# EAGLE design stm_teensy (EAGLE 9.5.2)
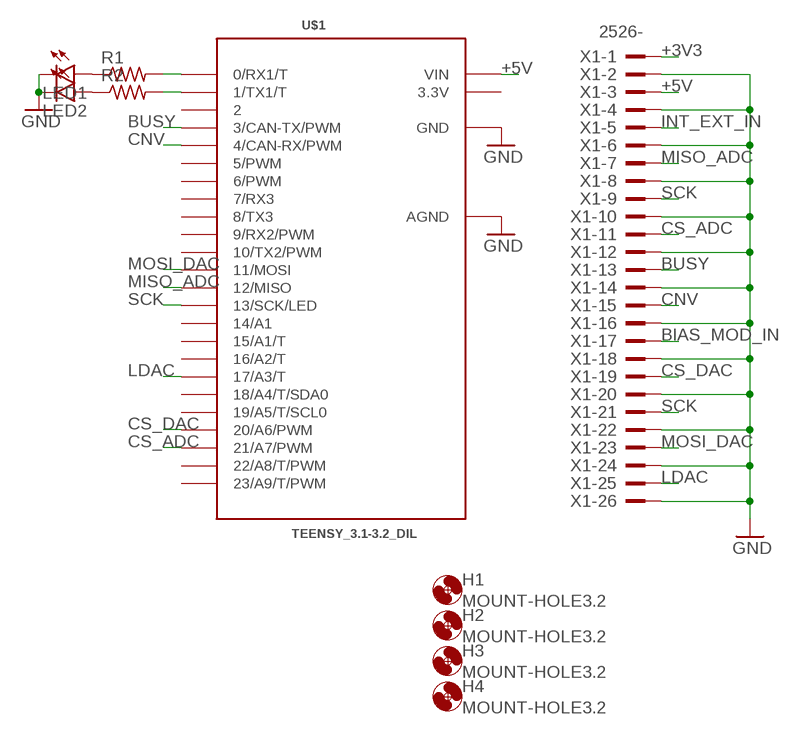
[diagram p0: schematic, sheet 1]

## Parts
H1  MOUNT-HOLE3.2  [3,2]
H2  MOUNT-HOLE3.2  [3,2]
H3  MOUNT-HOLE3.2  [3,2]
H4  MOUNT-HOLE3.2  [3,2]
LED1  LED5MM  [LED5MM]
LED2  LED5MM  [LED5MM]
R1  R-US_0204/7  [0204/7]
R2  R-US_0204/7  [0204/7]
U$1  TEENSY_3.1-3.2_DIL  [TEENSY_3.0-3.2&LC_DIL]
X1  2526-  [PAK100/2500-26]

## Nets
+3V3: X1.1
+5V: U$1.VIN X1.3
BIAS_MOD_IN: X1.17
BUSY: U$1.3(3/CAN-TX/PWM) X1.13
CNV: U$1.4(4/CAN-RX/PWM) X1.15
CS_ADC: U$1.21/A7(21/A7/PWM) X1.11
CS_DAC: U$1.20/A6(20/A6/PWM) X1.19
GND: LED1.K(C) LED2.K(C) U$1.AGND U$1.GND X1.2 X1.4 X1.6 X1.8 X1.10 X1.12 X1.14 X1.16 X1.18 X1.20 X1.22 X1.24 X1.26
INT_EXT_IN: X1.5
LDAC: U$1.17/A3(17/A3/T) X1.25
MISO_ADC: U$1.12(12/MISO) X1.7
MOSI_DAC: U$1.11(11/MOSI) X1.23
N$1: LED1.A R1.1
N$2: LED2.A R2.1
N$10: R1.2 U$1.0(0/RX1/T)
N$11: R2.2 U$1.1(1/TX1/T)
SCK: U$1.13(13/SCK/LED) X1.9 X1.21
Unconnected: U$1.2 U$1.5(5/PWM) U$1.6(6/PWM) U$1.7(7/RX3) U$1.8(8/TX3) U$1.9(9/RX2/PWM) U$1.10(10/TX2/PWM) U$1.14/A0(14/A1) U$1.15/A1(15/A1/T) U$1.16/A2(16/A2/T) U$1.18/A4(18/A4/T/SDA0) U$1.19/A5(19/A5/T/SCL0) U$1.22/A8(22/A8/T/PWM) U$1.23/A9(23/A9/T/PWM)

## Power pins joined to a net without a drawn wire
3.3V: U$1.3.3V

## Library data of the parts
H1-H4 = holes:MOUNT-HOLE: MOUNTING HOLE with drill center marker
LED1 LED2 = led:LED: LED OSRAM: - CHIPLED LG R971, LG N971, LY N971, LG Q971, LY Q971, LO R971, LY R971 LH N974, LH R974 LS Q976, LO Q976, LY Q976 LO Q996 - Hyper CHIPLED LW Q18S LB Q993, LB Q99A, LB R99A - SideLED LS A670, LO A670, LY A670, LG A670, LP A670 LB A673, LV A673, LT A673, LW A673 LH A674 LY A675 LS A676, LA A676, LO A676, LY A676, LW A676 LS A679, LY A679, LG A679 - Hyper Micro SIDELED® LS Y876, LA Y876, LO Y876, LY Y876 LT Y87S - SmartLED LW L88C, LW L88S LB L89C, LB L89S, LG L890 LS L89K, LO L89K, LY L89K LS L896, LA L896, LO L896, LY L896 - TOPLED LS T670, LO T670, LY T670, LG T670, LP T670 LSG T670, LSP T670, LSY T670, LOP T670, LYG T670 LG T671, LOG T671, LSG T671 LB T673, LV T673, LT T673, LW T673 LH T674 LS T676, LA T676, LO T676, LY T676, LB T676, LH T676, LSB T676, LW T676 LB T67C, LV T67C, LT T67C, LS T67K, LO T67K, LY T67K, LW E67C LS E67B, LA E67B, LO E67B, LY E67B, LB E67C, LV E67C, LT E67C LW T67C LS T679, LY T679, LG T679 LS T770, LO T770, LY T770, LG T770, LP T770 LB T773, LV T773, LT T773, LW T773 LH T774 LS E675, LA E675, LY E675, LS T675 LS T776, LA T776, LO T776, LY T776, LB T776 LHGB T686 LT T68C, LB T68C - Hyper Mini TOPLED® LB M676 - Mini TOPLED Santana® LG M470 LS M47K, LO M47K, LY M47K Source: http://www.osram.convergy.de LUXEON: - LUMILED® LXK2-PW12-R00, LXK2-PW12-S00, LXK2-PW14-U00, LXK2-PW14-V00 LXK2-PM12-R00, LXK2-PM12-S00, LXK2-PM14-U00 LXK2-PE12-Q00, LXK2-PE12-R00, LXK2-PE12-S00, LXK2-PE14-T00, LXK2-PE14-U00 LXK2-PB12-K00, LXK2-PB12-L00, LXK2-PB12-M00, LXK2-PB14-N00, LXK2-PB14-P00, LXK2-PB14-Q00 LXK2-PR12-L00, LXK2-PR12-M00, LXK2-PR14-Q00, LXK2-PR14-R00 LXK2-PD12-Q00, LXK2-PD12-R00, LXK2-PD12-S00 LXK2-PH12-R00, LXK2-PH12-S00 LXK2-PL12-P00, LXK2-PL12-Q00, LXK2-PL12-R00 Source: www.luxeon.com KINGBRIGHT: KA-3528ASYC Source: www.kingbright.com
R1 R2 = rcl:R-US_: RESISTOR, American symbol; SPICEPREFIX: R
U$1 = Teensy_3_and_LC_Series_Boards_v1.4:TEENSY_3.1-3.2_DIL: Teensy 3.1 or 3.2 in a DIL Layout.
X1 = con-3m:2526-: 3M (TM) Pak 100 4-Wall Header Source: 3M; OC_FARNELL: unknown; OC_NEWARK: unknown

## Board
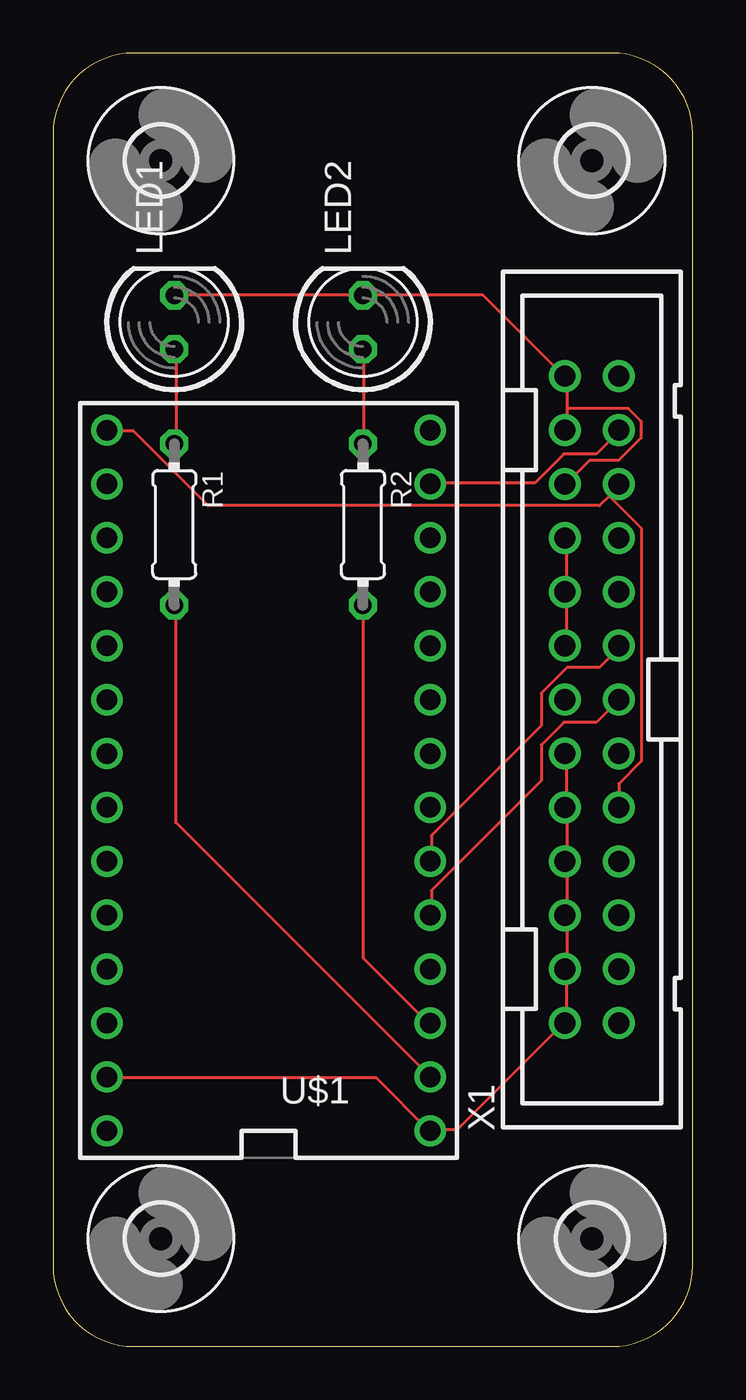
[diagram p1: board, top side]
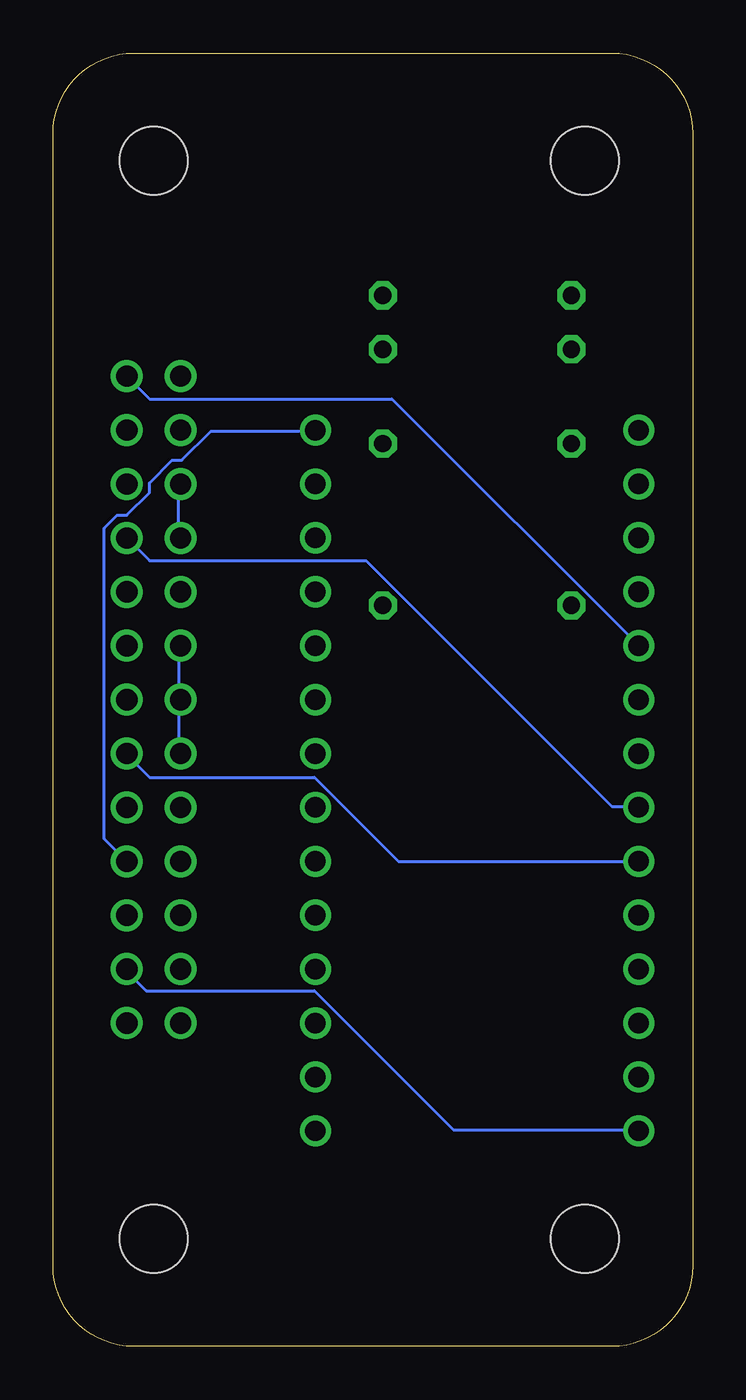
[diagram p2: board, bottom side, seen from below]

Size 30.15 x 60.95 mm. Coordinates in mm from the lower left corner, seen from the top.
Outline: 0,57.14 0,3.81 arc90 3.81,0 26.34,0 arc90 30.15,3.81 30.15,57.14 arc90 26.34,60.95 3.81,60.95 arc90 0,57.14
Copper layers (1*16): Top 0.035mm / dielectric 1.5mm / Bottom 0.035mm
Design rules "default": minimum track width 6mil, minimum drill 0.35mm, track to track 6mil, track to pad 6mil, pad to pad 6mil, via to via 6mil, smd to smd 6mil, copper to edge 40mil, drill to drill 6mil, minimum pad ring 10mil, minimum via ring 8mil, stop-mask expansion 4mil, vias tented up to drill 0mil, thermal gap 10mil

### Footprints (pad centres in the part's own frame; a part is rotated, then mirrored left to right if it is on the bottom)
3,2 = hole 3.2: 0,0
LED5MM = drill 0.813 octagon: A -1.27,0; K 1.27,0
0204/7 = drill 0.813 octagon: 1 -3.81,0; 2 3.81,0
TEENSY_3.0-3.2&LC_DIL = drill 0.965: 0 -7.62,13.97; 1 -7.62,11.43; 2 -7.62,8.89; 3 -7.62,6.35; 3.3V 7.62,11.43; 4 -7.62,3.81; 5 -7.62,1.27; 6 -7.62,-1.27; 7 -7.62,-3.81; 8 -7.62,-6.35; 9 -7.62,-8.89; 10 -7.62,-11.43; 11 -7.62,-13.97; 12 -7.62,-16.51; 13 7.62,-16.51; 14/A0 7.62,-13.97; 15/A1 7.62,-11.43; 16/A2 7.62,-8.89; 17/A3 7.62,-6.35; 18/A4 7.62,-3.81; 19/A5 7.62,-1.27; 20/A6 7.62,1.27; 21/A7 7.62,3.81; 22/A8 7.62,6.35; 23/A9 7.62,8.89; AGND 7.62,13.97; GND -7.62,16.51; VIN 7.62,16.51
PAK100/2500-26 = drill 1 pad 1.422: 1 -15.24,-1.27; 2 -15.24,1.27; 3 -12.7,-1.27; 4 -12.7,1.27; 5 -10.16,-1.27; 6 -10.16,1.27; 7 -7.62,-1.27; 8 -7.62,1.27; 9 -5.08,-1.27; 10 -5.08,1.27; 11 -2.54,-1.27; 12 -2.54,1.27; 13 0,-1.27; 14 0,1.27; 15 2.54,-1.27; 16 2.54,1.27; 17 5.08,-1.27; 18 5.08,1.27; 19 7.62,-1.27; 20 7.62,1.27; 21 10.16,-1.27; 22 10.16,1.27; 23 12.7,-1.27; 24 12.7,1.27; 25 15.24,-1.27; 26 15.24,1.27

### Placement (x,y rotation side)
H1  25.4,5.08 0 top
H2  25.4,55.88 0 top
H3  5.08,55.88 0 top
H4  5.08,5.08 0 top
LED1  5.71,48.26 90 top
LED2  14.61,48.26 90 top
R1  5.71,38.73 270 top
R2  14.61,38.73 270 top
U$1  10.16,26.67 180 top
X1  25.4,30.48 90 top

### Tracks (layer width: path | path; a pad name or v marks a point on that pad's centre or on a via)
+5V
  Bottom 0.152: U$1.VIN 2.59,10.21 11.28,10.21 17.83,16.76 25.76,16.76 26.67,17.68 X1.3
BUSY
  Top 0.152: X1.13 25.6,29.41 24.08,29.41 23.01,28.35 23.01,26.67 17.83,21.49 17.83,20.42 U$1.3
CNV
  Top 0.152: U$1.4 17.83,22.86 17.83,24.08 23.01,29.26 23.01,30.79 24.23,32 25.76,32 26.67,32.92 X1.15
CS_ADC
  Bottom 0.152: U$1.21/A7 13.87,22.86 17.83,26.82 25.6,26.82 26.67,27.89 X1.11
CS_DAC
  Bottom 0.152: X1.19 25.6,37.03 15.39,37.03 3.81,25.45 2.59,25.45 U$1.20/A6
GND
  Top 0.152: U$1.AGND 2.59,12.65 15.24,12.65 17.68,10.21 U$1.GND 17.83,10.21 19.05,10.21 24.08,15.24 X1.2 24.23,15.24 24.23,17.68 X1.4 24.23,17.83 24.23,20.27 X1.6 24.23,20.42 24.23,22.86 | LED1.K LED2.K 20.27,49.53 24.08,45.72 X1.26 24.23,45.72 24.23,44.2 | 24.23,22.86 24.23,25.3 X1.10 24.23,25.45 24.23,27.89 X1.12 | 24.23,44.2 24.23,43.28 X1.24 | X1.16 24.23,33.07 24.23,35.51 X1.18 24.23,35.66 24.23,38.1 X1.20 | 24.23,44.2 27.13,44.2 27.74,43.59 27.74,42.82 26.67,41.76 25.3,41.76 24.23,40.69 X1.22 | 24.23,22.86 X1.8
  Bottom 0.152: 24.23,30.48 24.23,32.92 X1.16 | X1.22 24.23,40.54 24.23,38.1 X1.20 | 24.23,30.48 24.23,28.04 X1.12 | 24.23,30.48 X1.14
LDAC
  Bottom 0.152: U$1.17/A3 14.17,44.65 25.6,44.65 X1.25
MISO_ADC
  Bottom 0.152: X1.7 27.74,23.93 27.74,38.56 27.13,39.17 26.67,39.17 25.6,40.23 25.6,40.69 24.54,41.76 24.08,41.76 22.71,43.13 17.83,43.13 U$1.12
MOSI_DAC
  Top 0.152: U$1.11 17.83,40.69 22.71,40.69 24.08,42.06 25.6,42.06 26.67,43.13 X1.23
N$1
  Top 0.152: R1.1 5.79,42.67 5.79,46.94 LED1.A
N$2
  Top 0.152: R2.1 14.63,42.67 14.63,46.94 LED2.A
N$10
  Top 0.152: U$1.0 5.79,24.69 5.79,34.9 R1.2
N$11
  Top 0.152: R2.2 14.63,34.9 14.63,18.29 17.68,15.24 U$1.1
SCK
  Top 0.152: 26.21,40.08 26.67,40.54 X1.21 26.21,40.08 | 26.21,40.08 25.76,39.62 7.32,39.62 3.81,43.13 2.59,43.13 U$1.13 | X1.9 26.67,26.52 27.74,27.58 27.74,38.56 26.21,40.08